# EAGLE schematic axiom_beta_board_100_v0.8_test.914f3e23 (EAGLE 7.0.0)

## Sheet 1 of 5
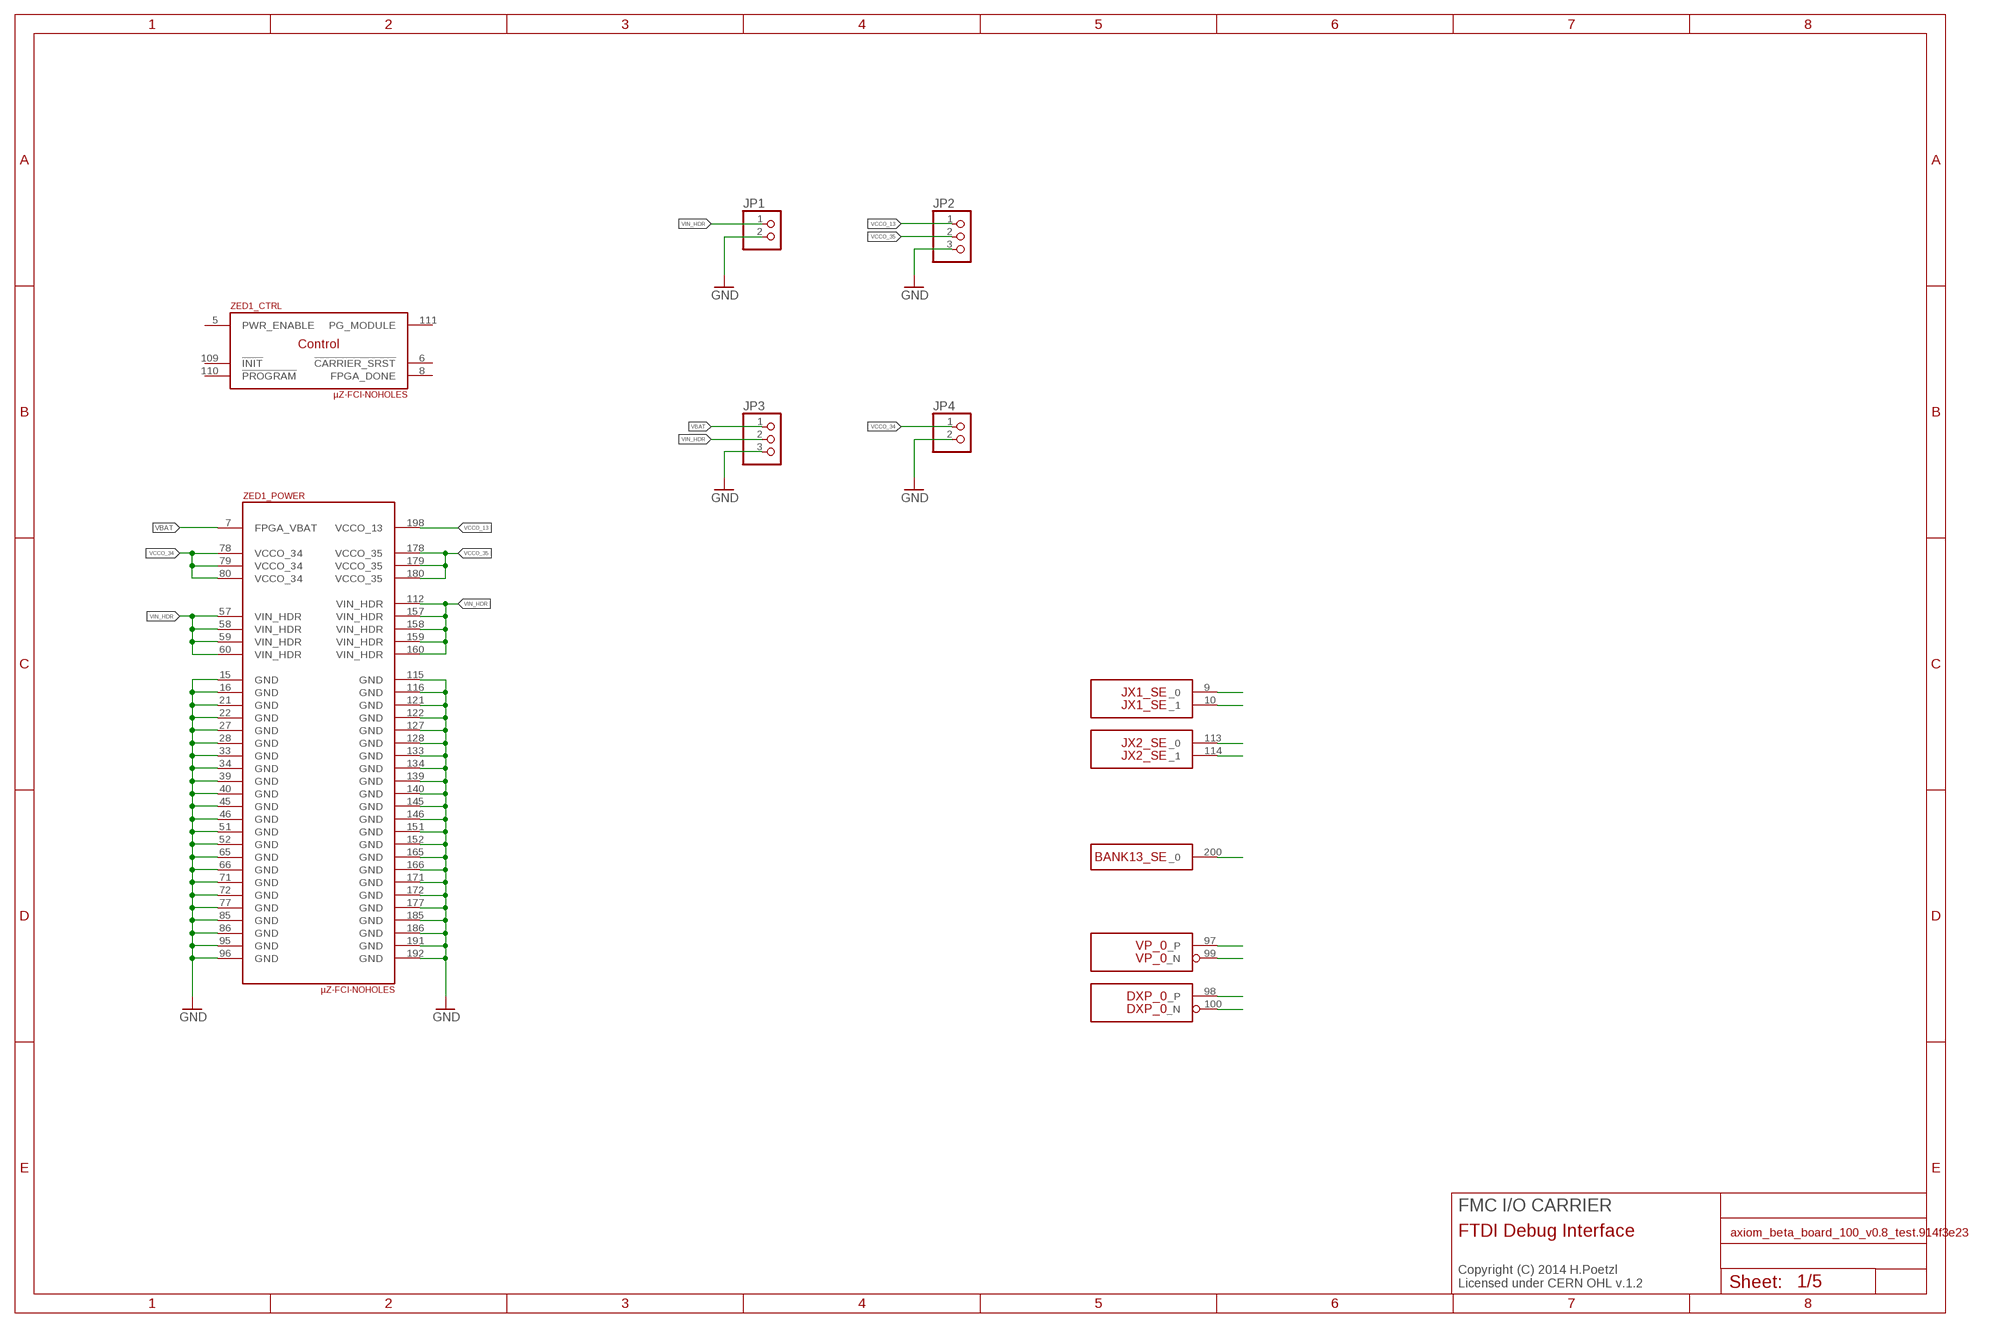
[diagram p0: schematic, sheet 1]

### Parts
JP1  PINHD-1X02_2.54  [1X02]
JP2  PINHD-1X03_2.54  [1X03]
JP3  PINHD-1X03_2.54  [1X03]
JP4  PINHD-1X02_2.54  [1X02]
ZED1  µZ-FCI-NOHOLES  [µZ-NOHOLES]

### Nets
GND: JP1.2 JP2.3 JP3.3 JP4.2 ZED1.15(_POWER:GND) ZED1.16(_POWER:GND) ZED1.21(_POWER:GND) ZED1.22(_POWER:GND) ZED1.27(_POWER:GND) ZED1.28(_POWER:GND) ZED1.33(_POWER:GND) ZED1.34(_POWER:GND) ZED1.39(_POWER:GND) ZED1.40(_POWER:GND) ZED1.45(_POWER:GND) ZED1.46(_POWER:GND) ZED1.51(_POWER:GND) ZED1.52(_POWER:GND) ZED1.65(_POWER:GND) ZED1.66(_POWER:GND) ZED1.71(_POWER:GND) ZED1.72(_POWER:GND) ZED1.77(_POWER:GND) ZED1.85(_POWER:GND) ZED1.86(_POWER:GND) ZED1.95(_POWER:GND) ZED1.96(_POWER:GND) ZED1.115(_POWER:GND) ZED1.116(_POWER:GND) ZED1.121(_POWER:GND) ZED1.122(_POWER:GND) ZED1.127(_POWER:GND) ZED1.128(_POWER:GND) ZED1.133(_POWER:GND) ZED1.134(_POWER:GND) ZED1.139(_POWER:GND) ZED1.140(_POWER:GND) ZED1.145(_POWER:GND) ZED1.146(_POWER:GND) ZED1.151(_POWER:GND) ZED1.152(_POWER:GND) ZED1.165(_POWER:GND) ZED1.166(_POWER:GND) ZED1.171(_POWER:GND) ZED1.172(_POWER:GND) ZED1.177(_POWER:GND) ZED1.185(_POWER:GND) ZED1.186(_POWER:GND) ZED1.191(_POWER:GND) ZED1.192(_POWER:GND) ; also sheet 2,4,5
N$1: ZED1.9(JX1_SE:_0)
N$46: ZED1.10(JX1_SE:_1)
N$47: ZED1.113(JX2_SE:_0)
N$48: ZED1.114(JX2_SE:_1)
N$49: ZED1.200(BANK13_SE:_0)
N$50: ZED1.97(VP_0:_P)
N$51: ZED1.99(VP_0:_N)
N$52: ZED1.98(DXP_0:_P)
N$53: ZED1.100(DXP_0:_N)
VBAT: JP3.1 ZED1.7(_POWER:FPGA_VBAT)
VCCO_13 [LVDS]: JP2.1 ZED1.198(_POWER:VCCO_13)
VCCO_34: JP4.1 ZED1.78(_POWER:VCCO_34) ZED1.79(_POWER:VCCO_34) ZED1.80(_POWER:VCCO_34)
VCCO_35: JP2.2 ZED1.178(_POWER:VCCO_35) ZED1.179(_POWER:VCCO_35) ZED1.180(_POWER:VCCO_35)
VIN_HDR [LVDS]: JP1.1 JP3.2 ZED1.57(_POWER:VIN_HDR) ZED1.58(_POWER:VIN_HDR) ZED1.59(_POWER:VIN_HDR) ZED1.60(_POWER:VIN_HDR) ZED1.112(_POWER:VIN_HDR) ZED1.157(_POWER:VIN_HDR) ZED1.158(_POWER:VIN_HDR) ZED1.159(_POWER:VIN_HDR) ZED1.160(_POWER:VIN_HDR)
Unconnected: ZED1.5(_CTRL:PWR_ENABLE) ZED1.6(_CTRL:!CARRIER_SRST) ZED1.8(_CTRL:FPGA_DONE) ZED1.101(_PMOD:PMOD_D0) ZED1.102(_PMOD:PMOD_D1) ZED1.103(_PMOD:PMOD_D2) ZED1.104(_PMOD:PMOD_D3) ZED1.105(_PMOD:PMOD_D4) ZED1.106(_PMOD:PMOD_D5) ZED1.107(_PMOD:PMOD_D6) ZED1.108(_PMOD:PMOD_D7) ZED1.109(_CTRL:!INIT) ZED1.110(_CTRL:!PROGRAM) ZED1.111(_CTRL:PG_MODULE)

### Notes on the sheet
- FMC I/O CARRIER
- FTDI Debug Interface
- Copyright (C) 2014 H.Poetzl
  Licensed under CERN OHL v.1.2

## Sheet 2 of 5
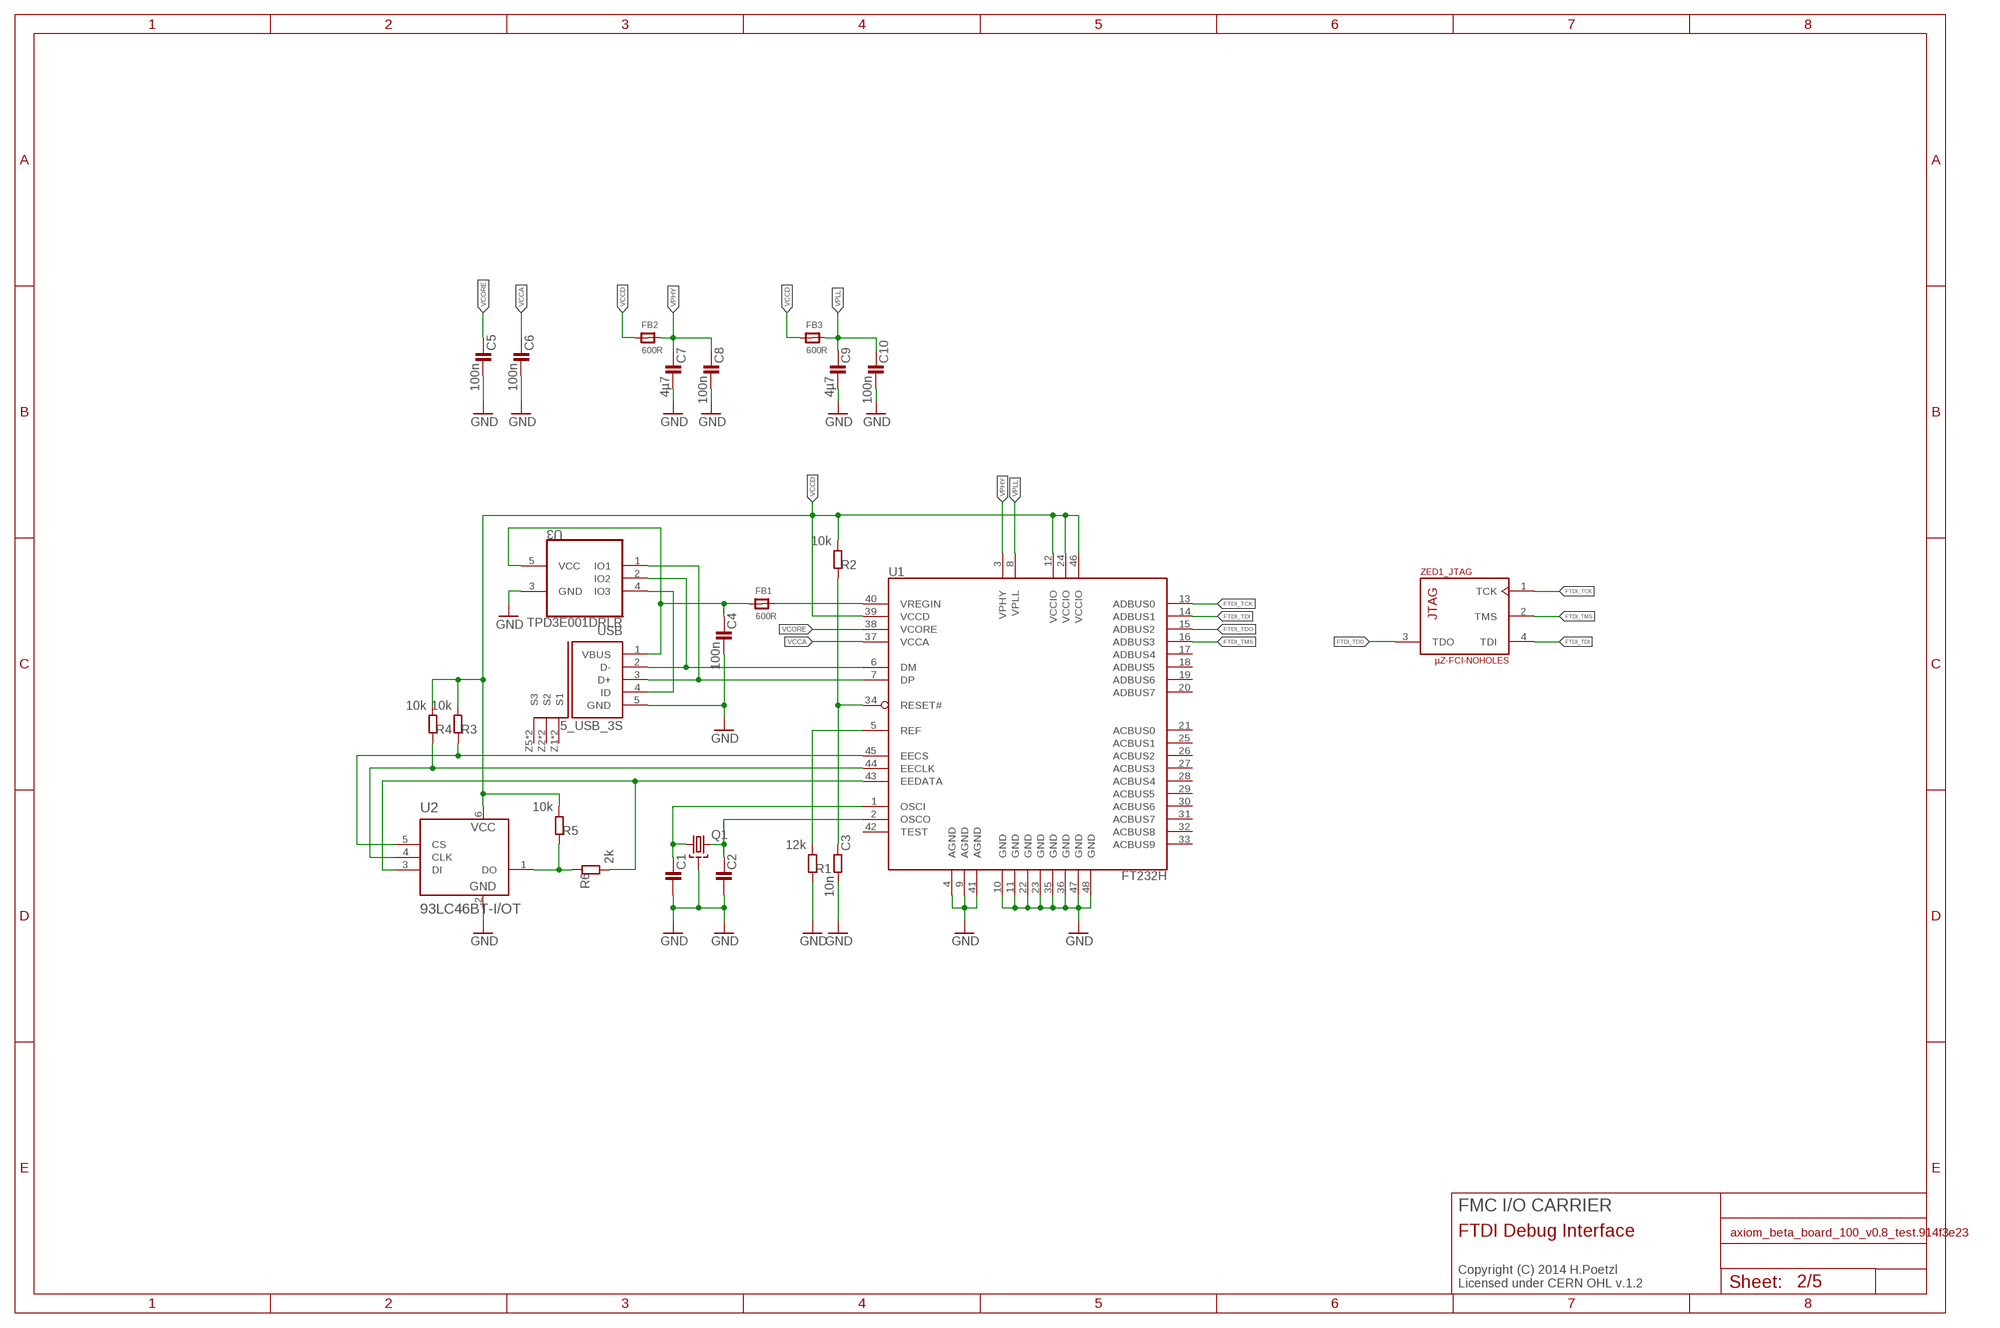
[diagram p1: schematic, sheet 2]

### Parts
C1  C0402-B  [0402-B]
C2  C0402-B  [0402-B]
C3  10n  R0402-B  [0402-B]
C4  100n  C0603-B  [0603-B]
C5  100n  C0402-B  [0402-B]
C6  100n  C0402-B  [0402-B]
C7  4µ7  C0603-B  [0603-B]
C8  100n  C0402-B  [0402-B]
C9  4µ7  C0603-B  [0603-B]
C10  100n  C0402-B  [0402-B]
FB1  600R  FERRITE_0603MP  [_0603MP]
FB2  600R  FERRITE_0603MP  [_0603MP]
FB3  600R  FERRITE_0603MP  [_0603MP]
Q1  SMD-4P-2G-3.2X2.5  [ABM8G]
R1  12k  R0402-B  [0402-B]
R2  10k  R0402-B  [0402-B]
R3  10k  R0402-B  [0402-B]
R4  10k  R0402-B  [0402-B]
R5  10k  R0402-B  [0402-B]
R6  2k  R0402-B  [0402-B]
U1  FT232H  [LQFP48]
U2  93LC46BT-I/OT  [SOT95P280X145-6N]
U3  TPD3E001DRLR  [SOT50P160X60-5N]
USB  5_USB_3S  [MICRO-AB-H-SMT]

### Nets
EE_CLK1: R4.1 U1.44(EECLK) U2.4(CLK)
EE_CS1: R3.1 U1.45(EECS) U2.5(CS)
EE_DATA1: R6.2 U1.43(EEDATA) U2.3(DI)
FTDI_D_N: U1.6(DM) U3.2(IO2) USB.2(D-)
FTDI_D_P: U1.7(DP) U3.1(IO1) USB.3(D+)
FTDI_TCK: U1.13(ADBUS0) ZED1.1(_JTAG:TCK)
FTDI_TDI: U1.14(ADBUS1) ZED1.4(_JTAG:TDI)
FTDI_TDO: U1.15(ADBUS2) ZED1.3(_JTAG:TDO)
FTDI_TMS: U1.16(ADBUS3) ZED1.2(_JTAG:TMS)
GND: C1.2 C2.2 C3.2 C4.2 C5.2 C6.2 C7.2 C8.2 C9.2 C10.2 Q1.2(GND) Q1.4(GND) R1.1 U1.4(AGND) U1.9(AGND) U1.10(GND) U1.11(GND) U1.22(GND) U1.23(GND) U1.35(GND) U1.36(GND) U1.41(AGND) U1.47(GND) U1.48(GND) U2.2(VSS) U3.3(GND) USB.5(GND) ; also sheet 1,4,5
N$177: R5.1 R6.1 U2.1(DO)
N$178: C1.1 Q1.1 U1.1(OSCI)
N$179: C2.1 Q1.3 U1.2(OSCO)
N$180: C3.1 R2.1 U1.34(RESET#)
N$181: R1.2 U1.5(REF)
N$182: U3.4(IO3) USB.4(ID)
VBUS: C4.1 FB1.1 U3.5(VCC) USB.1(VBUS)
VCCA: C6.1 U1.37(VCCA)
VCCD: FB2.1 FB3.1 R2.2 R3.2 R4.2 R5.2 U1.12(VCCIO) U1.24(VCCIO) U1.39(VCCD) U1.46(VCCIO) U2.6(VCC)
VCORE: C5.1 U1.38(VCORE)
VPHY: C7.1 C8.1 FB2.2 U1.3(VPHY)
VPLL: C9.1 C10.1 FB3.2 U1.8(VPLL)
VREGIN: FB1.2 U1.40(VREGIN)
Unconnected: U1.17(ADBUS4) U1.18(ADBUS5) U1.19(ADBUS6) U1.20(ADBUS7) U1.21(ACBUS0) U1.25(ACBUS1) U1.26(ACBUS2) U1.27(ACBUS3) U1.28(ACBUS4) U1.29(ACBUS5) U1.30(ACBUS6) U1.31(ACBUS7) U1.32(ACBUS8) U1.33(ACBUS9) U1.42(TEST) USB.Z1(S1) USB.Z2(S2) USB.Z3(S2) USB.Z4(S1) USB.Z5(S3) USB.Z6(S3)

### Notes on the sheet
- FMC I/O CARRIER
- FTDI Debug Interface
- Copyright (C) 2014 H.Poetzl
  Licensed under CERN OHL v.1.2

## Sheet 3 of 5
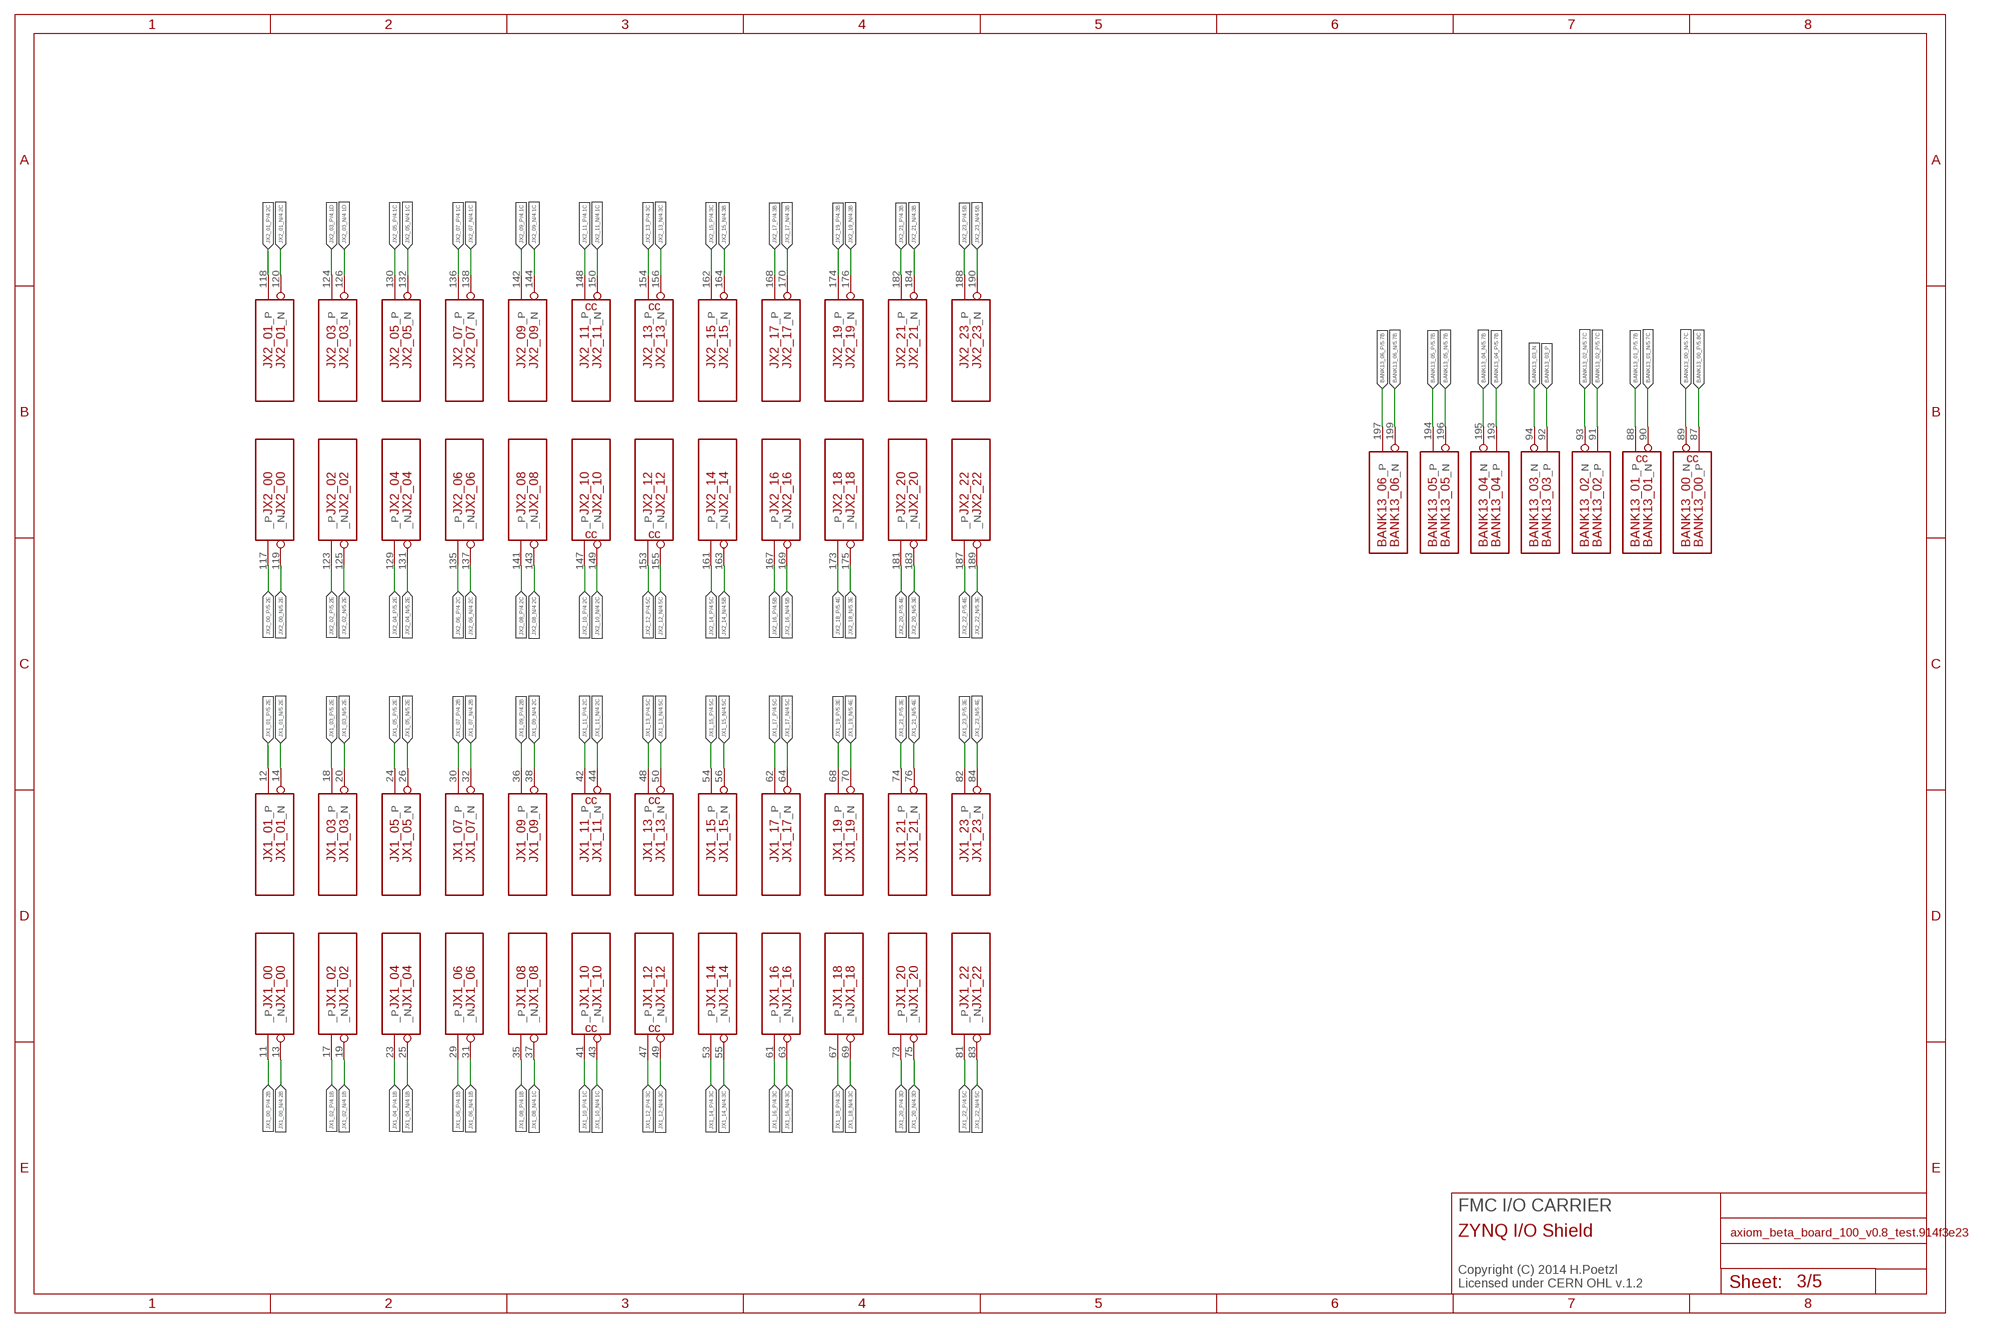
[diagram p2: schematic, sheet 3]

### Nets
BANK13_00_N [LVDS]: ZED1.89(BANK13_00:_N) ; also sheet 5
BANK13_00_P [LVDS]: ZED1.87(BANK13_00:_P) ; also sheet 5
BANK13_01_N [LVDS]: ZED1.90(BANK13_01:_N) ; also sheet 5
BANK13_01_P [LVDS]: ZED1.88(BANK13_01:_P) ; also sheet 5
BANK13_02_N [LVDS]: ZED1.93(BANK13_02:_N) ; also sheet 5
BANK13_02_P [LVDS]: ZED1.91(BANK13_02:_P) ; also sheet 5
BANK13_03_N [LVDS]: ZED1.94(BANK13_03:_N)
BANK13_03_P [LVDS]: ZED1.92(BANK13_03:_P)
BANK13_04_N [LVDS]: ZED1.195(BANK13_04:_N) ; also sheet 5
BANK13_04_P [LVDS]: ZED1.193(BANK13_04:_P) ; also sheet 5
BANK13_05_N: ZED1.196(BANK13_05:_N) ; also sheet 5
BANK13_05_P: ZED1.194(BANK13_05:_P) ; also sheet 5
BANK13_06_N [LVDS]: ZED1.199(BANK13_06:_N) ; also sheet 5
BANK13_06_P [LVDS]: ZED1.197(BANK13_06:_P) ; also sheet 5
JX1_00_N [LVDS]: ZED1.13(JX1_00:_N) ; also sheet 4
JX1_00_P [LVDS]: ZED1.11(JX1_00:_P) ; also sheet 4
JX1_01_N [LVDS]: ZED1.14(JX1_01:_N) ; also sheet 5
JX1_01_P [LVDS]: ZED1.12(JX1_01:_P) ; also sheet 5
JX1_02_N [LVDS]: ZED1.19(JX1_02:_N) ; also sheet 4
JX1_02_P [LVDS]: ZED1.17(JX1_02:_P) ; also sheet 4
JX1_03_N [LVDS]: ZED1.20(JX1_03:_N) ; also sheet 5
JX1_03_P [LVDS]: ZED1.18(JX1_03:_P) ; also sheet 5
JX1_04_N [LVDS]: ZED1.25(JX1_04:_N) ; also sheet 4
JX1_04_P [LVDS]: ZED1.23(JX1_04:_P) ; also sheet 4
JX1_05_N: ZED1.26(JX1_05:_N) ; also sheet 5
JX1_05_P: ZED1.24(JX1_05:_P) ; also sheet 5
JX1_06_N [LVDS]: ZED1.31(JX1_06:_N) ; also sheet 4
JX1_06_P [LVDS]: ZED1.29(JX1_06:_P) ; also sheet 4
JX1_07_N [LVDS]: ZED1.32(JX1_07:_N) ; also sheet 4
JX1_07_P [LVDS]: ZED1.30(JX1_07:_P) ; also sheet 4
JX1_08_N: ZED1.37(JX1_08:_N) ; also sheet 4
JX1_08_P: ZED1.35(JX1_08:_P) ; also sheet 4
JX1_09_N [LVDS]: ZED1.38(JX1_09:_N) ; also sheet 4
JX1_09_P [LVDS]: ZED1.36(JX1_09:_P) ; also sheet 4
JX1_10_N [LVDS]: ZED1.43(JX1_10:_N) ; also sheet 4
JX1_10_P [LVDS]: ZED1.41(JX1_10:_P) ; also sheet 4
JX1_11_N [LVDS]: ZED1.44(JX1_11:_N) ; also sheet 4
JX1_11_P [LVDS]: ZED1.42(JX1_11:_P) ; also sheet 4
JX1_12_N [LVDS]: ZED1.49(JX1_12:_N) ; also sheet 4
JX1_12_P [LVDS]: ZED1.47(JX1_12:_P) ; also sheet 4
JX1_13_N [LVDS]: ZED1.50(JX1_13:_N) ; also sheet 4
JX1_13_P [LVDS]: ZED1.48(JX1_13:_P) ; also sheet 4
JX1_14_N [LVDS]: ZED1.55(JX1_14:_N) ; also sheet 4
JX1_14_P [LVDS]: ZED1.53(JX1_14:_P) ; also sheet 4
JX1_15_N: ZED1.56(JX1_15:_N) ; also sheet 4
JX1_15_P: ZED1.54(JX1_15:_P) ; also sheet 4
JX1_16_N [LVDS]: ZED1.63(JX1_16:_N) ; also sheet 4
JX1_16_P [LVDS]: ZED1.61(JX1_16:_P) ; also sheet 4
JX1_17_N [LVDS]: ZED1.64(JX1_17:_N) ; also sheet 4
JX1_17_P [LVDS]: ZED1.62(JX1_17:_P) ; also sheet 4
JX1_18_N [LVDS]: ZED1.69(JX1_18:_N) ; also sheet 4
JX1_18_P [LVDS]: ZED1.67(JX1_18:_P) ; also sheet 4
JX1_19_N [LVDS]: ZED1.70(JX1_19:_N) ; also sheet 5
JX1_19_P [LVDS]: ZED1.68(JX1_19:_P) ; also sheet 5
JX1_20_N: ZED1.75(JX1_20:_N) ; also sheet 4
JX1_20_P: ZED1.73(JX1_20:_P) ; also sheet 4
JX1_21_N: ZED1.76(JX1_21:_N) ; also sheet 5
JX1_21_P: ZED1.74(JX1_21:_P) ; also sheet 5
JX1_22_N: ZED1.83(JX1_22:_N) ; also sheet 4
JX1_22_P: ZED1.81(JX1_22:_P) ; also sheet 4
JX1_23_N [LVDS]: ZED1.84(JX1_23:_N) ; also sheet 5
JX1_23_P [LVDS]: ZED1.82(JX1_23:_P) ; also sheet 5
JX2_00_N [LVDS]: ZED1.119(JX2_00:_N) ; also sheet 5
JX2_00_P [LVDS]: ZED1.117(JX2_00:_P) ; also sheet 5
JX2_01_N [LVDS]: ZED1.120(JX2_01:_N) ; also sheet 4
JX2_01_P [LVDS]: ZED1.118(JX2_01:_P) ; also sheet 4
JX2_02_N [LVDS]: ZED1.125(JX2_02:_N) ; also sheet 5
JX2_02_P [LVDS]: ZED1.123(JX2_02:_P) ; also sheet 5
JX2_03_N [LVDS]: ZED1.126(JX2_03:_N) ; also sheet 4
JX2_03_P [LVDS]: ZED1.124(JX2_03:_P) ; also sheet 4
JX2_04_N [LVDS]: ZED1.131(JX2_04:_N) ; also sheet 5
JX2_04_P [LVDS]: ZED1.129(JX2_04:_P) ; also sheet 5
JX2_05_N [LVDS]: ZED1.132(JX2_05:_N) ; also sheet 4
JX2_05_P [LVDS]: ZED1.130(JX2_05:_P) ; also sheet 4
JX2_06_N [LVDS]: ZED1.137(JX2_06:_N) ; also sheet 4
JX2_06_P [LVDS]: ZED1.135(JX2_06:_P) ; also sheet 4
JX2_07_N [LVDS]: ZED1.138(JX2_07:_N) ; also sheet 4
JX2_07_P [LVDS]: ZED1.136(JX2_07:_P) ; also sheet 4
JX2_08_N [LVDS]: ZED1.143(JX2_08:_N) ; also sheet 4
JX2_08_P [LVDS]: ZED1.141(JX2_08:_P) ; also sheet 4
JX2_09_N [LVDS]: ZED1.144(JX2_09:_N) ; also sheet 4
JX2_09_P [LVDS]: ZED1.142(JX2_09:_P) ; also sheet 4
JX2_10_N [LVDS]: ZED1.149(JX2_10:_N) ; also sheet 4
JX2_10_P [LVDS]: ZED1.147(JX2_10:_P) ; also sheet 4
JX2_11_N [LVDS]: ZED1.150(JX2_11:_N) ; also sheet 4
JX2_11_P [LVDS]: ZED1.148(JX2_11:_P) ; also sheet 4
JX2_12_N [LVDS]: ZED1.155(JX2_12:_N) ; also sheet 4
JX2_12_P [LVDS]: ZED1.153(JX2_12:_P) ; also sheet 4
JX2_13_N [LVDS]: ZED1.156(JX2_13:_N) ; also sheet 4
JX2_13_P [LVDS]: ZED1.154(JX2_13:_P) ; also sheet 4
JX2_14_N: ZED1.163(JX2_14:_N) ; also sheet 4
JX2_14_P: ZED1.161(JX2_14:_P) ; also sheet 4
JX2_15_N [LVDS]: ZED1.164(JX2_15:_N) ; also sheet 4
JX2_15_P [LVDS]: ZED1.162(JX2_15:_P) ; also sheet 4
JX2_16_N [LVDS]: ZED1.169(JX2_16:_N) ; also sheet 4
JX2_16_P [LVDS]: ZED1.167(JX2_16:_P) ; also sheet 4
JX2_17_N [LVDS]: ZED1.170(JX2_17:_N) ; also sheet 4
JX2_17_P [LVDS]: ZED1.168(JX2_17:_P) ; also sheet 4
JX2_18_N [LVDS]: ZED1.175(JX2_18:_N) ; also sheet 5
JX2_18_P [LVDS]: ZED1.173(JX2_18:_P) ; also sheet 5
JX2_19_N [LVDS]: ZED1.176(JX2_19:_N) ; also sheet 4
JX2_19_P [LVDS]: ZED1.174(JX2_19:_P) ; also sheet 4
JX2_20_N [LVDS]: ZED1.183(JX2_20:_N) ; also sheet 5
JX2_20_P [LVDS]: ZED1.181(JX2_20:_P) ; also sheet 5
JX2_21_N [LVDS]: ZED1.184(JX2_21:_N) ; also sheet 4
JX2_21_P [LVDS]: ZED1.182(JX2_21:_P) ; also sheet 4
JX2_22_N: ZED1.189(JX2_22:_N) ; also sheet 5
JX2_22_P: ZED1.187(JX2_22:_P) ; also sheet 5
JX2_23_N [LVDS]: ZED1.190(JX2_23:_N) ; also sheet 4
JX2_23_P [LVDS]: ZED1.188(JX2_23:_P) ; also sheet 4

### Notes on the sheet
- FMC I/O CARRIER
- ZYNQ I/O Shield
- Copyright (C) 2014 H.Poetzl
  Licensed under CERN OHL v.1.2

## Sheet 4 of 5
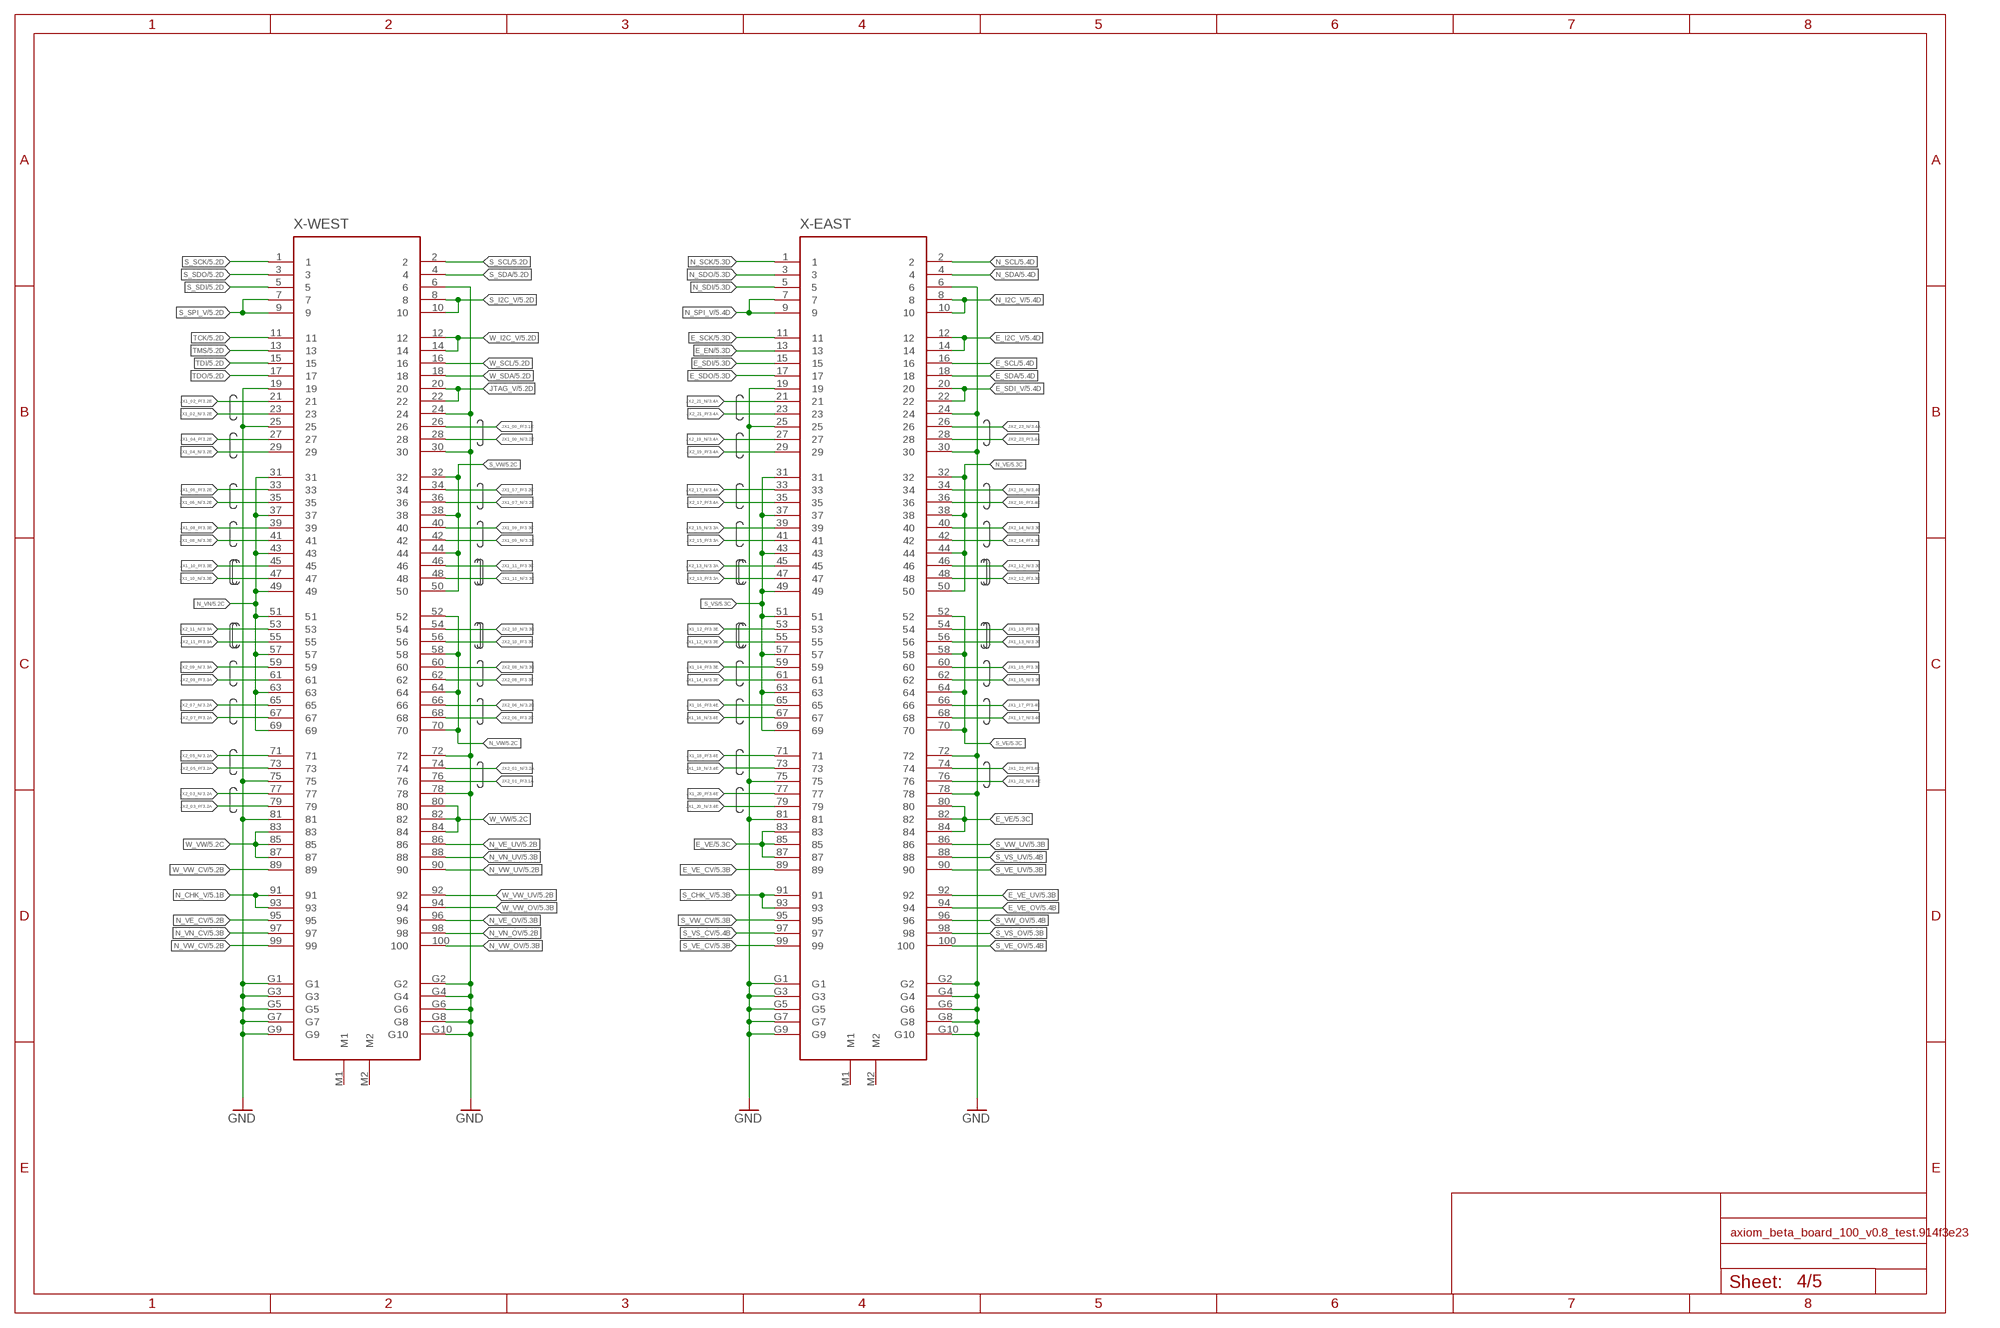
[diagram p3: schematic, sheet 4]

### Parts
X-EAST  FX10-100/10S  [FX10A-100S/10]
X-WEST  FX10-100/10S  [FX10A-100S/10]

### Nets
E_EN: X-EAST.13 ; also sheet 5
E_I2C_V: X-EAST.12 X-EAST.14 ; also sheet 5
E_SCK: X-EAST.11 ; also sheet 5
E_SCL: X-EAST.16 ; also sheet 5
E_SDA: X-EAST.18 ; also sheet 5
E_SDI: X-EAST.15 ; also sheet 5
E_SDI_V: X-EAST.20 X-EAST.22 ; also sheet 5
E_SDO: X-EAST.17 ; also sheet 5
E_VE: X-EAST.80 X-EAST.82 X-EAST.83 X-EAST.84 X-EAST.85 X-EAST.87 ; also sheet 5
E_VE_CV: X-EAST.89 ; also sheet 5
E_VE_OV: X-EAST.94 ; also sheet 5
E_VE_UV: X-EAST.92 ; also sheet 5
GND: X-EAST.6 X-EAST.19 X-EAST.24 X-EAST.25 X-EAST.30 X-EAST.72 X-EAST.75 X-EAST.78 X-EAST.81 X-EAST.G1 X-EAST.G2 X-EAST.G3 X-EAST.G4 X-EAST.G5 X-EAST.G6 X-EAST.G7 X-EAST.G8 X-EAST.G9 X-EAST.G10 X-WEST.6 X-WEST.19 X-WEST.24 X-WEST.25 X-WEST.30 X-WEST.72 X-WEST.75 X-WEST.78 X-WEST.81 X-WEST.G1 X-WEST.G2 X-WEST.G3 X-WEST.G4 X-WEST.G5 X-WEST.G6 X-WEST.G7 X-WEST.G8 X-WEST.G9 X-WEST.G10 ; also sheet 1,2,5
JTAG_V: X-WEST.20 X-WEST.22 ; also sheet 5
JX1_00_N [LVDS]: X-WEST.28 ; also sheet 3
JX1_00_P [LVDS]: X-WEST.26 ; also sheet 3
JX1_02_N [LVDS]: X-WEST.23 ; also sheet 3
JX1_02_P [LVDS]: X-WEST.21 ; also sheet 3
JX1_04_N [LVDS]: X-WEST.29 ; also sheet 3
JX1_04_P [LVDS]: X-WEST.27 ; also sheet 3
JX1_06_N [LVDS]: X-WEST.35 ; also sheet 3
JX1_06_P [LVDS]: X-WEST.33 ; also sheet 3
JX1_07_N [LVDS]: X-WEST.36 ; also sheet 3
JX1_07_P [LVDS]: X-WEST.34 ; also sheet 3
JX1_08_N: X-WEST.41 ; also sheet 3
JX1_08_P: X-WEST.39 ; also sheet 3
JX1_09_N [LVDS]: X-WEST.42 ; also sheet 3
JX1_09_P [LVDS]: X-WEST.40 ; also sheet 3
JX1_10_N [LVDS]: X-WEST.47 ; also sheet 3
JX1_10_P [LVDS]: X-WEST.45 ; also sheet 3
JX1_11_N [LVDS]: X-WEST.48 ; also sheet 3
JX1_11_P [LVDS]: X-WEST.46 ; also sheet 3
JX1_12_N [LVDS]: X-EAST.55 ; also sheet 3
JX1_12_P [LVDS]: X-EAST.53 ; also sheet 3
JX1_13_N [LVDS]: X-EAST.56 ; also sheet 3
JX1_13_P [LVDS]: X-EAST.54 ; also sheet 3
JX1_14_N [LVDS]: X-EAST.61 ; also sheet 3
JX1_14_P [LVDS]: X-EAST.59 ; also sheet 3
JX1_15_N: X-EAST.62 ; also sheet 3
JX1_15_P: X-EAST.60 ; also sheet 3
JX1_16_N [LVDS]: X-EAST.67 ; also sheet 3
JX1_16_P [LVDS]: X-EAST.65 ; also sheet 3
JX1_17_N [LVDS]: X-EAST.68 ; also sheet 3
JX1_17_P [LVDS]: X-EAST.66 ; also sheet 3
JX1_18_N [LVDS]: X-EAST.73 ; also sheet 3
JX1_18_P [LVDS]: X-EAST.71 ; also sheet 3
JX1_20_N: X-EAST.79 ; also sheet 3
JX1_20_P: X-EAST.77 ; also sheet 3
JX1_22_N: X-EAST.76 ; also sheet 3
JX1_22_P: X-EAST.74 ; also sheet 3
JX2_01_N [LVDS]: X-WEST.74 ; also sheet 3
JX2_01_P [LVDS]: X-WEST.76 ; also sheet 3
JX2_03_N [LVDS]: X-WEST.77 ; also sheet 3
JX2_03_P [LVDS]: X-WEST.79 ; also sheet 3
JX2_05_N [LVDS]: X-WEST.71 ; also sheet 3
JX2_05_P [LVDS]: X-WEST.73 ; also sheet 3
JX2_06_N [LVDS]: X-WEST.66 ; also sheet 3
JX2_06_P [LVDS]: X-WEST.68 ; also sheet 3
JX2_07_N [LVDS]: X-WEST.65 ; also sheet 3
JX2_07_P [LVDS]: X-WEST.67 ; also sheet 3
JX2_08_N [LVDS]: X-WEST.60 ; also sheet 3
JX2_08_P [LVDS]: X-WEST.62 ; also sheet 3
JX2_09_N [LVDS]: X-WEST.59 ; also sheet 3
JX2_09_P [LVDS]: X-WEST.61 ; also sheet 3
JX2_10_N [LVDS]: X-WEST.54 ; also sheet 3
JX2_10_P [LVDS]: X-WEST.56 ; also sheet 3
JX2_11_N [LVDS]: X-WEST.53 ; also sheet 3
JX2_11_P [LVDS]: X-WEST.55 ; also sheet 3
JX2_12_N [LVDS]: X-EAST.46 ; also sheet 3
JX2_12_P [LVDS]: X-EAST.48 ; also sheet 3
JX2_13_N [LVDS]: X-EAST.45 ; also sheet 3
JX2_13_P [LVDS]: X-EAST.47 ; also sheet 3
JX2_14_N: X-EAST.40 ; also sheet 3
JX2_14_P: X-EAST.42 ; also sheet 3
JX2_15_N [LVDS]: X-EAST.39 ; also sheet 3
JX2_15_P [LVDS]: X-EAST.41 ; also sheet 3
JX2_16_N [LVDS]: X-EAST.34 ; also sheet 3
JX2_16_P [LVDS]: X-EAST.36 ; also sheet 3
JX2_17_N [LVDS]: X-EAST.33 ; also sheet 3
JX2_17_P [LVDS]: X-EAST.35 ; also sheet 3
JX2_19_N [LVDS]: X-EAST.27 ; also sheet 3
JX2_19_P [LVDS]: X-EAST.29 ; also sheet 3
JX2_21_N [LVDS]: X-EAST.21 ; also sheet 3
JX2_21_P [LVDS]: X-EAST.23 ; also sheet 3
JX2_23_N [LVDS]: X-EAST.26 ; also sheet 3
JX2_23_P [LVDS]: X-EAST.28 ; also sheet 3
N_CHK_V: X-WEST.91 X-WEST.93 ; also sheet 5
N_I2C_V: X-EAST.8 X-EAST.10 ; also sheet 5
N_SCK: X-EAST.1 ; also sheet 5
N_SCL: X-EAST.2 ; also sheet 5
N_SDA: X-EAST.4 ; also sheet 5
N_SDI: X-EAST.5 ; also sheet 5
N_SDO: X-EAST.3 ; also sheet 5
N_SPI_V: X-EAST.7 X-EAST.9 ; also sheet 5
N_VE: X-EAST.32 X-EAST.38 X-EAST.44 X-EAST.50 ; also sheet 5
N_VE_CV: X-WEST.95 ; also sheet 5
N_VE_OV: X-WEST.96 ; also sheet 5
N_VE_UV: X-WEST.86 ; also sheet 5
N_VN: X-WEST.31 X-WEST.37 X-WEST.43 X-WEST.49 X-WEST.51 X-WEST.57 X-WEST.63 X-WEST.69 ; also sheet 5
N_VN_CV: X-WEST.97 ; also sheet 5
N_VN_OV: X-WEST.98 ; also sheet 5
N_VN_UV: X-WEST.88 ; also sheet 5
N_VW: X-WEST.52 X-WEST.58 X-WEST.64 X-WEST.70 ; also sheet 5
N_VW_CV: X-WEST.99 ; also sheet 5
N_VW_OV: X-WEST.100 ; also sheet 5
N_VW_UV: X-WEST.90 ; also sheet 5
S_CHK_V: X-EAST.91 X-EAST.93 ; also sheet 5
S_I2C_V: X-WEST.8 X-WEST.10 ; also sheet 5
S_SCK: X-WEST.1 ; also sheet 5
S_SCL: X-WEST.2 ; also sheet 5
S_SDA: X-WEST.4 ; also sheet 5
S_SDI: X-WEST.5 ; also sheet 5
S_SDO: X-WEST.3 ; also sheet 5
S_SPI_V: X-WEST.7 X-WEST.9 ; also sheet 5
S_VE: X-EAST.52 X-EAST.58 X-EAST.64 X-EAST.70 ; also sheet 5
S_VE_CV: X-EAST.99 ; also sheet 5
S_VE_OV: X-EAST.100 ; also sheet 5
S_VE_UV: X-EAST.90 ; also sheet 5
S_VS: X-EAST.31 X-EAST.37 X-EAST.43 X-EAST.49 X-EAST.51 X-EAST.57 X-EAST.63 X-EAST.69 ; also sheet 5
S_VS_CV: X-EAST.97 ; also sheet 5
S_VS_OV: X-EAST.98 ; also sheet 5
S_VS_UV: X-EAST.88 ; also sheet 5
S_VW: X-WEST.32 X-WEST.38 X-WEST.44 X-WEST.50 ; also sheet 5
S_VW_CV: X-EAST.95 ; also sheet 5
S_VW_OV: X-EAST.96 ; also sheet 5
S_VW_UV: X-EAST.86 ; also sheet 5
TCK: X-WEST.11 ; also sheet 5
TDI: X-WEST.15 ; also sheet 5
TDO: X-WEST.17 ; also sheet 5
TMS: X-WEST.13 ; also sheet 5
W_I2C_V: X-WEST.12 X-WEST.14 ; also sheet 5
W_SCL: X-WEST.16 ; also sheet 5
W_SDA: X-WEST.18 ; also sheet 5
W_VW: X-WEST.80 X-WEST.82 X-WEST.83 X-WEST.84 X-WEST.85 X-WEST.87 ; also sheet 5
W_VW_CV: X-WEST.89 ; also sheet 5
W_VW_OV: X-WEST.94 ; also sheet 5
W_VW_UV: X-WEST.92 ; also sheet 5
Unconnected: X-EAST.M1 X-EAST.M2 X-WEST.M1 X-WEST.M2

## Sheet 5 of 5
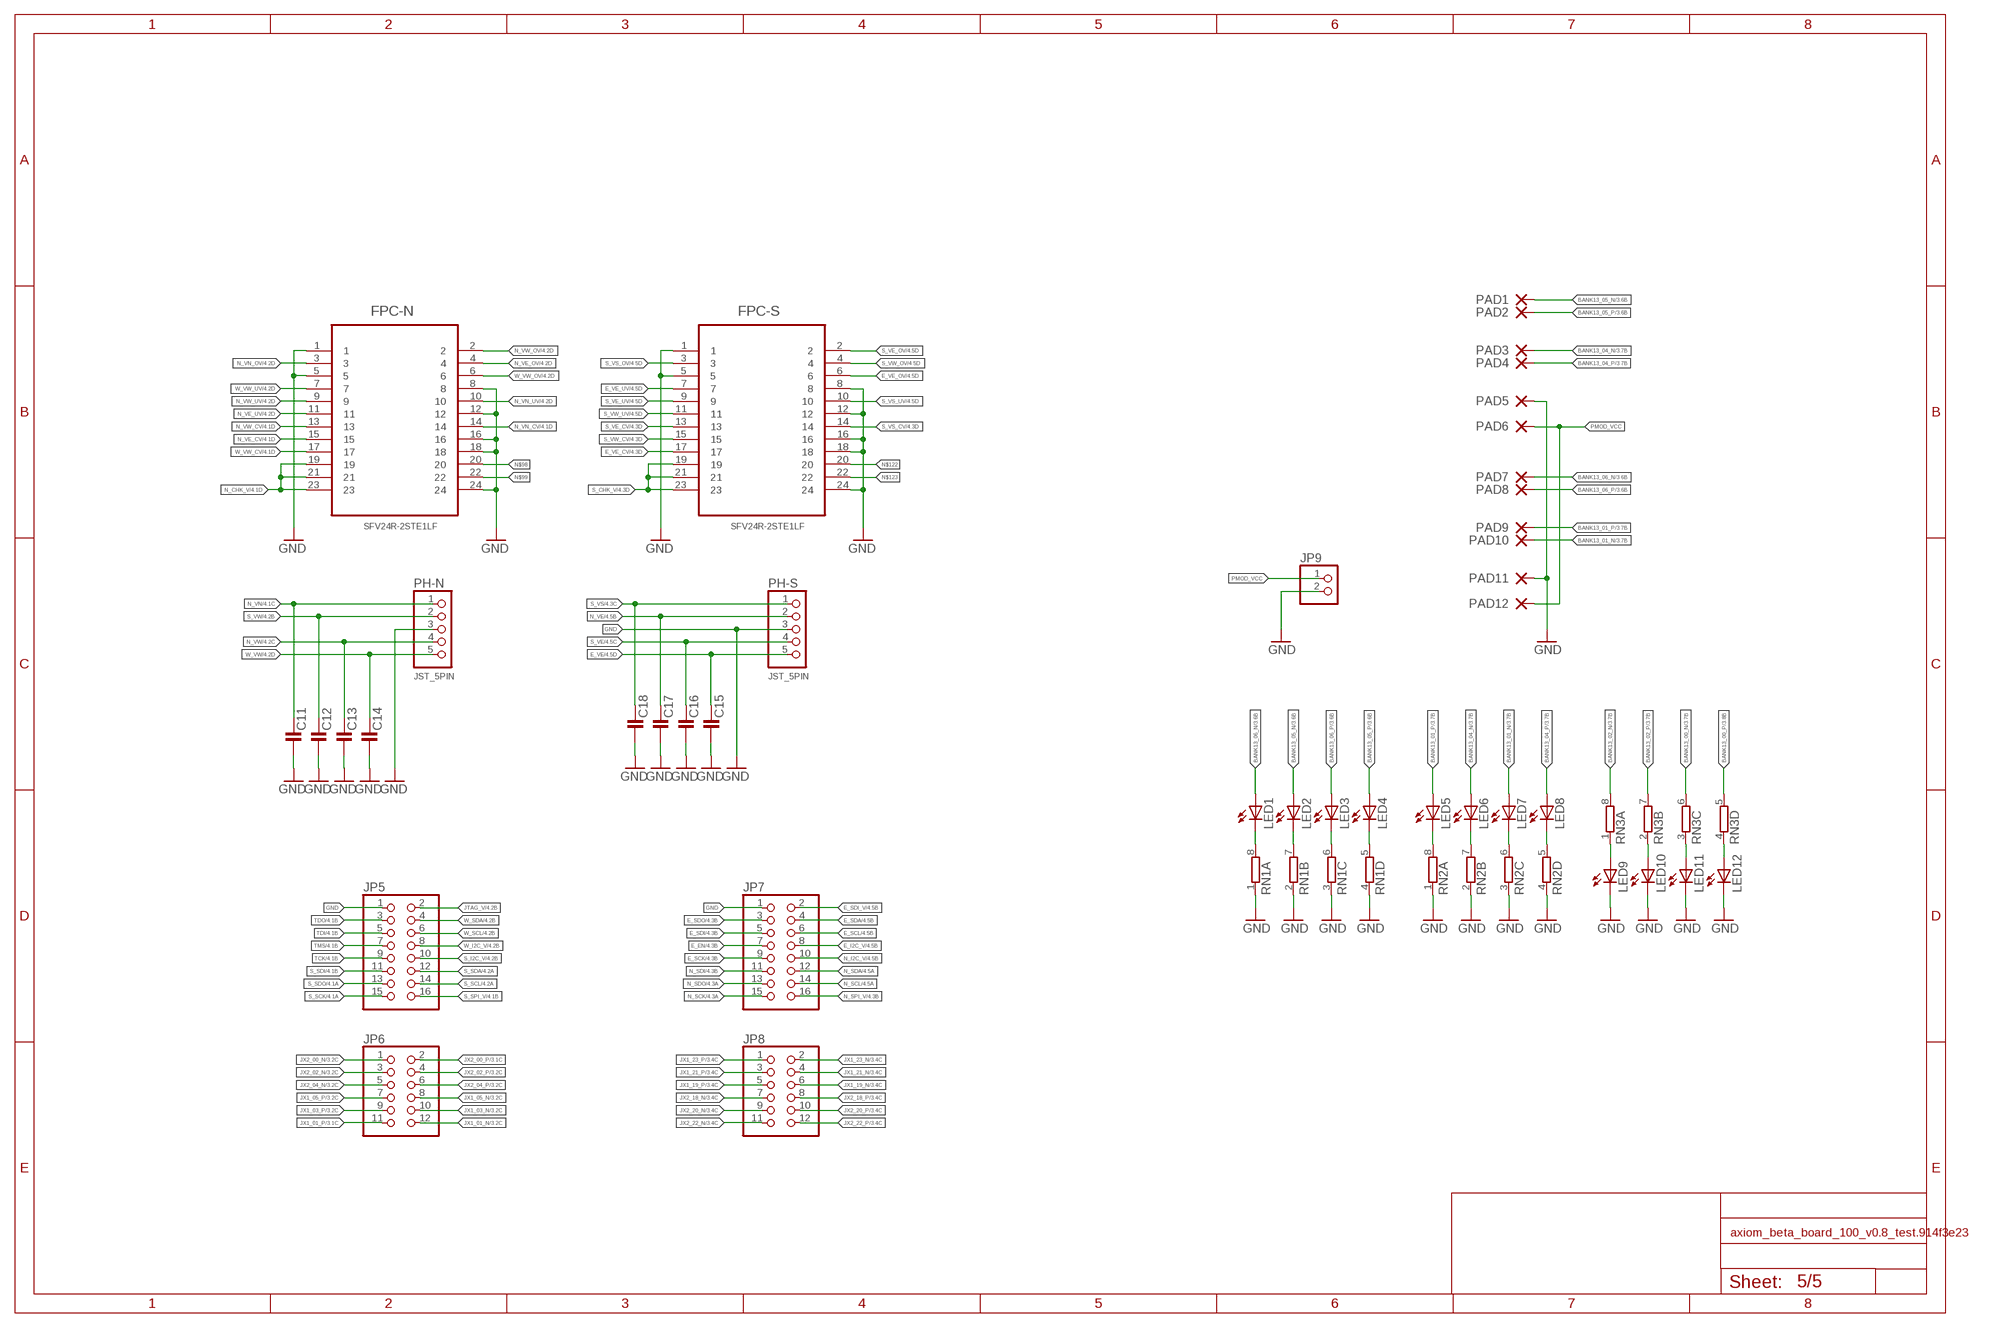
[diagram p4: schematic, sheet 5]

### Parts
C11  C1206-B  [1206-B]
C12  C1206-B  [1206-B]
C13  C1206-B  [1206-B]
C14  C1206-B  [1206-B]
C15  C1206-B  [1206-B]
C16  C1206-B  [1206-B]
C17  C1206-B  [1206-B]
C18  C1206-B  [1206-B]
FPC-N  SFV24R-2STE1LF  [FCI_SFV24R-2STE1LF]
FPC-S  SFV24R-2STE1LF  [FCI_SFV24R-2STE1LF]
JP5  PINHD-2X08_2.54  [2X08]
JP6  PINHD-2X06_2.54  [2X06]
JP7  PINHD-2X08_2.54  [2X08]
JP8  PINHD-2X06_2.54  [2X06]
JP9  PINHD-1X02_2.54  [1X02]
LED1  LEDCHIPLED_0603  [CHIPLED_0603]
LED2  LEDCHIPLED_0603  [CHIPLED_0603]
LED3  LEDCHIPLED_0603  [CHIPLED_0603]
LED4  LEDCHIPLED_0603  [CHIPLED_0603]
LED5  LEDCHIPLED_0603  [CHIPLED_0603]
LED6  LEDCHIPLED_0603  [CHIPLED_0603]
LED7  LEDCHIPLED_0603  [CHIPLED_0603]
LED8  LEDCHIPLED_0603  [CHIPLED_0603]
LED9  LEDCHIPLED_0603  [CHIPLED_0603]
LED10  LEDCHIPLED_0603  [CHIPLED_0603]
LED11  LEDCHIPLED_0603  [CHIPLED_0603]
LED12  LEDCHIPLED_0603  [CHIPLED_0603]
PAD1  SMD-PAD1.6X3.8MM-U  [1.6X3.8U-MM]
PAD2  SMD-PAD1.6X3.8MM-U  [1.6X3.8U-MM]
PAD3  SMD-PAD1.6X3.8MM-U  [1.6X3.8U-MM]
PAD4  SMD-PAD1.6X3.8MM-U  [1.6X3.8U-MM]
PAD5  SMD-PAD1.6X3.8MM-U  [1.6X3.8U-MM]
PAD6  SMD-PAD1.6X3.8MM-U  [1.6X3.8U-MM]
PAD7  SMD-PAD1.6X3.8MM-U  [1.6X3.8U-MM]
PAD8  SMD-PAD1.6X3.8MM-U  [1.6X3.8U-MM]
PAD9  SMD-PAD1.6X3.8MM-U  [1.6X3.8U-MM]
PAD10  SMD-PAD1.6X3.8MM-U  [1.6X3.8U-MM]
PAD11  SMD-PAD1.6X3.8MM-U  [1.6X3.8U-MM]
PAD12  SMD-PAD1.6X3.8MM-U  [1.6X3.8U-MM]
PH-N  JST_5PIN  [JST-PH-5-SMT-RA]
PH-S  JST_5PIN  [JST-PH-5-SMT-RA]
RN1  4R-NCAY16  [CAY16]
RN2  4R-NCAY16  [CAY16]
RN3  4R-NCAY16  [CAY16]

### Nets
BANK13_00_N [LVDS]: RN3.6 ; also sheet 3
BANK13_00_P [LVDS]: RN3.5 ; also sheet 3
BANK13_01_N [LVDS]: LED7.A PAD10.1(P) ; also sheet 3
BANK13_01_P [LVDS]: LED5.A PAD9.1(P) ; also sheet 3
BANK13_02_N [LVDS]: RN3.8 ; also sheet 3
BANK13_02_P [LVDS]: RN3.7 ; also sheet 3
BANK13_04_N [LVDS]: LED6.A PAD3.1(P) ; also sheet 3
BANK13_04_P [LVDS]: LED8.A PAD4.1(P) ; also sheet 3
BANK13_05_N: LED2.A PAD1.1(P) ; also sheet 3
BANK13_05_P: LED4.A PAD2.1(P) ; also sheet 3
BANK13_06_N [LVDS]: LED1.A PAD7.1(P) ; also sheet 3
BANK13_06_P [LVDS]: LED3.A PAD8.1(P) ; also sheet 3
E_EN: JP7.7 ; also sheet 4
E_I2C_V: JP7.8 ; also sheet 4
E_SCK: JP7.9 ; also sheet 4
E_SCL: JP7.6 ; also sheet 4
E_SDA: JP7.4 ; also sheet 4
E_SDI: JP7.5 ; also sheet 4
E_SDI_V: JP7.2 ; also sheet 4
E_SDO: JP7.3 ; also sheet 4
E_VE: C15.1 PH-S.5 ; also sheet 4
E_VE_CV: FPC-S.17 ; also sheet 4
E_VE_OV: FPC-S.6 ; also sheet 4
E_VE_UV: FPC-S.7 ; also sheet 4
GND: C11.2 C12.2 C13.2 C14.2 C15.2 C16.2 C17.2 C18.2 FPC-N.1 FPC-N.5 FPC-N.8 FPC-N.12 FPC-N.16 FPC-N.18 FPC-N.24 FPC-S.1 FPC-S.5 FPC-S.8 FPC-S.12 FPC-S.16 FPC-S.18 FPC-S.24 JP5.1 JP7.1 JP9.2 LED9.C LED10.C LED11.C LED12.C PAD5.1(P) PAD11.1(P) PH-N.3 PH-S.3 RN1.1 RN1.2 RN1.3 RN1.4 RN2.1 RN2.2 RN2.3 RN2.4 ; also sheet 1,2,4
JTAG_V: JP5.2 ; also sheet 4
JX1_01_N [LVDS]: JP6.12 ; also sheet 3
JX1_01_P [LVDS]: JP6.11 ; also sheet 3
JX1_03_N [LVDS]: JP6.10 ; also sheet 3
JX1_03_P [LVDS]: JP6.9 ; also sheet 3
JX1_05_N: JP6.8 ; also sheet 3
JX1_05_P: JP6.7 ; also sheet 3
JX1_19_N [LVDS]: JP8.6 ; also sheet 3
JX1_19_P [LVDS]: JP8.5 ; also sheet 3
JX1_21_N: JP8.4 ; also sheet 3
JX1_21_P: JP8.3 ; also sheet 3
JX1_23_N [LVDS]: JP8.2 ; also sheet 3
JX1_23_P [LVDS]: JP8.1 ; also sheet 3
JX2_00_N [LVDS]: JP6.1 ; also sheet 3
JX2_00_P [LVDS]: JP6.2 ; also sheet 3
JX2_02_N [LVDS]: JP6.3 ; also sheet 3
JX2_02_P [LVDS]: JP6.4 ; also sheet 3
JX2_04_N [LVDS]: JP6.5 ; also sheet 3
JX2_04_P [LVDS]: JP6.6 ; also sheet 3
JX2_18_N [LVDS]: JP8.7 ; also sheet 3
JX2_18_P [LVDS]: JP8.8 ; also sheet 3
JX2_20_N [LVDS]: JP8.9 ; also sheet 3
JX2_20_P [LVDS]: JP8.10 ; also sheet 3
JX2_22_N: JP8.11 ; also sheet 3
JX2_22_P: JP8.12 ; also sheet 3
N$98: FPC-N.20
N$99: FPC-N.22
N$105: LED1.C RN1.8
N$106: LED2.C RN1.7
N$107: LED3.C RN1.6
N$108: LED4.C RN1.5
N$109: LED5.C RN2.8
N$113: LED6.C RN2.7
N$114: LED7.C RN2.6
N$115: LED8.C RN2.5
N$116: LED9.A RN3.1
N$117: LED10.A RN3.2
N$118: LED11.A RN3.3
N$119: LED12.A RN3.4
N$122: FPC-S.20
N$123: FPC-S.22
N_CHK_V: FPC-N.19 FPC-N.21 FPC-N.23 ; also sheet 4
N_I2C_V: JP7.10 ; also sheet 4
N_SCK: JP7.15 ; also sheet 4
N_SCL: JP7.14 ; also sheet 4
N_SDA: JP7.12 ; also sheet 4
N_SDI: JP7.11 ; also sheet 4
N_SDO: JP7.13 ; also sheet 4
N_SPI_V: JP7.16 ; also sheet 4
N_VE: C17.1 PH-S.2 ; also sheet 4
N_VE_CV: FPC-N.15 ; also sheet 4
N_VE_OV: FPC-N.4 ; also sheet 4
N_VE_UV: FPC-N.11 ; also sheet 4
N_VN: C11.1 PH-N.1 ; also sheet 4
N_VN_CV: FPC-N.14 ; also sheet 4
N_VN_OV: FPC-N.3 ; also sheet 4
N_VN_UV: FPC-N.10 ; also sheet 4
N_VW: C13.1 PH-N.4 ; also sheet 4
N_VW_CV: FPC-N.13 ; also sheet 4
N_VW_OV: FPC-N.2 ; also sheet 4
N_VW_UV: FPC-N.9 ; also sheet 4
PMOD_VCC [LVDS]: JP9.1 PAD6.1(P) PAD12.1(P)
S_CHK_V: FPC-S.19 FPC-S.21 FPC-S.23 ; also sheet 4
S_I2C_V: JP5.10 ; also sheet 4
S_SCK: JP5.15 ; also sheet 4
S_SCL: JP5.14 ; also sheet 4
S_SDA: JP5.12 ; also sheet 4
S_SDI: JP5.11 ; also sheet 4
S_SDO: JP5.13 ; also sheet 4
S_SPI_V: JP5.16 ; also sheet 4
S_VE: C16.1 PH-S.4 ; also sheet 4
S_VE_CV: FPC-S.13 ; also sheet 4
S_VE_OV: FPC-S.2 ; also sheet 4
S_VE_UV: FPC-S.9 ; also sheet 4
S_VS: C18.1 PH-S.1 ; also sheet 4
S_VS_CV: FPC-S.14 ; also sheet 4
S_VS_OV: FPC-S.3 ; also sheet 4
S_VS_UV: FPC-S.10 ; also sheet 4
S_VW: C12.1 PH-N.2 ; also sheet 4
S_VW_CV: FPC-S.15 ; also sheet 4
S_VW_OV: FPC-S.4 ; also sheet 4
S_VW_UV: FPC-S.11 ; also sheet 4
TCK: JP5.9 ; also sheet 4
TDI: JP5.5 ; also sheet 4
TDO: JP5.3 ; also sheet 4
TMS: JP5.7 ; also sheet 4
W_I2C_V: JP5.8 ; also sheet 4
W_SCL: JP5.6 ; also sheet 4
W_SDA: JP5.4 ; also sheet 4
W_VW: C14.1 PH-N.5 ; also sheet 4
W_VW_CV: FPC-N.17 ; also sheet 4
W_VW_OV: FPC-N.6 ; also sheet 4
W_VW_UV: FPC-N.7 ; also sheet 4

## Library data of the parts
C1 C2 C4-C18 = generic-rcl:C
C3 R1-R6 = generic-rcl:R
FB1-FB3 = microbuilder:FERRITE: Ferrite Bead 0603 MMZ1608B121C - 120 Ohm @ 100MHz, 600mA, 0.15 Ohm DC Resistance - Digikey: 445-2164-1-ND BK1608HW121-T - 120 Ohm, 600mA Ferrite Chip - Digikey: 587-1876-2-ND 0805 HZ0805B272R-10 - 2.7K Ohm @ 100MHz, 200mA, 0.8 Ohm DC Resistance - Digikey: 240-2504-1-ND (see also Murata BLM21BD272SN1L) MMZ2012Y152B - 1.5K Ohm @ 100MHz, 500mA, 0.4 Ohm DC Resistance - Digikey: 445-1560-1-ND - Mainly for high frequency (80-400MHz) MMZ2012R102A - 1K Ohm @ 100MHz, 500mA, 0.3 Ohm DC Resistance - Digikey: 445-1555-2-ND - More general purpose (10-200MHz)
FPC-N FPC-S = FCI_By_element14_Batch_1:SFV24R-2STE1LF: FFC/FPC CONNECTOR, RECEPTACLE 24POS 1ROW; MPN: SFV24R-2STE1LF; OC_FARNELL: -; OC_NEWARK: 62K5584; PACKAGE: CONNECTOR - 24POS; SUPPLIER: FCI
JP1 JP4 JP9 = pinhead-2:PINHD-1X02: PIN HEADER
JP2 JP3 = pinhead-2:PINHD-1X03: PIN HEADER
JP5 JP7 = pinhead-2:PINHD-2X08: PIN HEADER
JP6 JP8 = pinhead-2:PINHD-2X06: PIN HEADER
LED1-LED12 = led:LED: LED OSRAM: - CHIPLED LG R971, LG N971, LY N971, LG Q971, LY Q971, LO R971, LY R971 LH N974, LH R974 LS Q976, LO Q976, LY Q976 LO Q996 - Hyper CHIPLED LW Q18S LB Q993, LB Q99A, LB R99A - SideLED LS A670, LO A670, LY A670, LG A670, LP A670 LB A673, LV A673, LT A673, LW A673 LH A674 LY A675 LS A676, LA A676, LO A676, LY A676, LW A676 LS A679, LY A679, LG A679 - Hyper Micro SIDELED® LS Y876, LA Y876, LO Y876, LY Y876 LT Y87S - SmartLED LW L88C, LW L88S LB L89C, LB L89S, LG L890 LS L89K, LO L89K, LY L89K LS L896, LA L896, LO L896, LY L896 - TOPLED LS T670, LO T670, LY T670, LG T670, LP T670 LSG T670, LSP T670, LSY T670, LOP T670, LYG T670 LG T671, LOG T671, LSG T671 LB T673, LV T673, LT T673, LW T673 LH T674 LS T676, LA T676, LO T676, LY T676, LB T676, LH T676, LSB T676, LW T676 LB T67C, LV T67C, LT T67C, LS T67K, LO T67K, LY T67K, LW E67C LS E67B, LA E67B, LO E67B, LY E67B, LB E67C, LV E67C, LT E67C LW T67C LS T679, LY T679, LG T679 LS T770, LO T770, LY T770, LG T770, LP T770 LB T773, LV T773, LT T773, LW T773 LH T774 LS E675, LA E675, LY E675, LS T675 LS T776, LA T776, LO T776, LY T776, LB T776 LHGB T686 LT T68C, LB T68C - Hyper Mini TOPLED® LB M676 - Mini TOPLED Santana® LG M470 LS M47K, LO M47K, LY M47K Source: http://www.osram.convergy.de LUXEON: - LUMILED® LXK2-PW12-R00, LXK2-PW12-S00, LXK2-PW14-U00, LXK2-PW14-V00 LXK2-PM12-R00, LXK2-PM12-S00, LXK2-PM14-U00 LXK2-PE12-Q00, LXK2-PE12-R00, LXK2-PE12-S00, LXK2-PE14-T00, LXK2-PE14-U00 LXK2-PB12-K00, LXK2-PB12-L00, LXK2-PB12-M00, LXK2-PB14-N00, LXK2-PB14-P00, LXK2-PB14-Q00 LXK2-PR12-L00, LXK2-PR12-M00, LXK2-PR14-Q00, LXK2-PR14-R00 LXK2-PD12-Q00, LXK2-PD12-R00, LXK2-PD12-S00 LXK2-PH12-R00, LXK2-PH12-S00 LXK2-PL12-P00, LXK2-PL12-Q00, LXK2-PL12-R00 Source: www.luxeon.com KINGBRIGHT: KA-3528ASYC Source: www.kingbright.com
PAD1-PAD12 = smd_pads:SMD-PAD: SMD PAD
PH-N PH-S = jst-ph:JST_5PIN
Q1 = xtal:SMD-4P-2G
RN1-RN3 = resistor-dil:4R-N: Array Chip Resistor Source: RS Component / Phycomp; OC_FARNELL: unknown; OC_NEWARK: unknown
U1 = ft232h:FT232H: FTDI FT232H DS: http://www.ftdichip.com/Support/Documents/DataSheets/ICs/DS_FT232H.pdf
U2 = 93lc46:93LC46BT-I/OT: 1K Microwire Compatible Serial EEPROM; MPN: 93LC46BT-I/OT; OC_FARNELL: 1556164; OC_NEWARK: 75M3689; PACKAGE: SOT-6; SUPPLIER: Microchip
U3 = esd:TPD3E001DRLR: LOW-CAPACITANCE 3-CHANNEL ±15-kV ESD-PROTECTION ARRAY FOR HIGH-SPEED DATA INTERFACES; MPN: TPD3E001DRLR; OC_FARNELL: 1603422; OC_NEWARK: 41M5842; PACKAGE: SOT-5; SUPPLIER: Texas Instruments
USB = usb:5_USB_3S; TE: 1981584
X-EAST X-WEST = fx10:FX10-100/10
ZED1 = microzed:µZ-FCI

## Net classes
0 default: width 0.152 mm, drill 0.254 mm, clearance 0.152 mm
1 LVDS: width 0.152 mm, drill 0.254 mm, clearance 0.152 mm